# Altium project PDC.PrjPCB (part 2 of 2)

## Sheet Analog_HC_Overcurrent_Redundancy.SchDoc
size A
Used 4 times, as channels U_ANALOG_HC_OVERCURRENT_REDUNDANCY_CCT/U_Analog_HC_Overcurrent_Redundancy, U_ANALOG_HC_OVERCURRENT_REDUNDANCY_CCT/U_Analog_HC_Overcurrent_Redundancy, U_ANALOG_HC_OVERCURRENT_REDUNDANCY_CCT/U_Analog_HC_Overcurrent_Redundancy, U_ANALOG_HC_OVERCURRENT_REDUNDANCY_CCT/U_Analog_HC_Overcurrent_Redundancy. Parts and nets are listed once, with the designators drawn on the sheet.
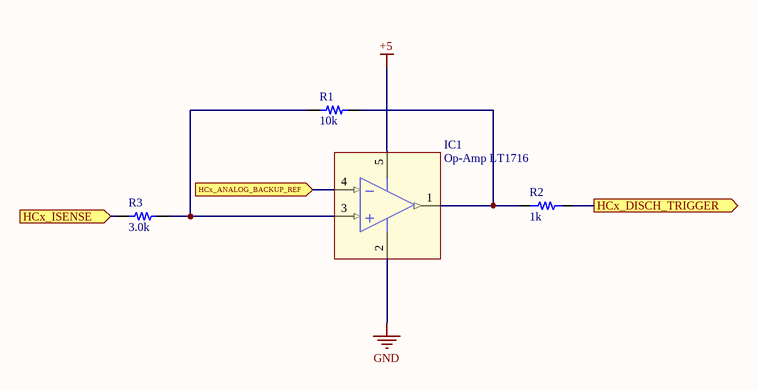
[diagram p16: Analog_HC_Overcurrent_Redundancy.SchDoc]

### Parts
IC1  Op-Amp LT1716  [SOT23-5]
R1  value 10k  [RES 0603/1608]  (hidden comment: Resistor 10k 0603 1/10W 1%)
R2  value 1k  [RES 0805/2012]  (hidden comment: Resistor 1k 0805 1/10W 1%)
R3  value 3.0k  [RES 0603/1608]  (hidden comment: Resistor 3.0k 0603 1/10W 1%)

### Ports
HCx_ANALOG_BACKUP_REF (in), HCx_DISCH_TRIGGER (out), HCx_ISENSE (in)

### Nets
+5: IC1.5(V+)
GND: IC1.2(V-)
HCx_ANALOG_BACKUP_REF: IC1.4(IN-) ; port HCx_ANALOG_BACKUP_REF
HCx_DISCH_TRIGGER: R2.2 ; port HCx_DISCH_TRIGGER
HCx_ISENSE: R3.1 ; port HCx_ISENSE
NetIC1_1: IC1.1(OUT) R1.2 R2.1
NetIC1_3: IC1.3(IN+) R1.1 R3.2

### Channels
U_ANALOG_HC_OVERCURRENT_REDUNDANCY_CCT/U_Analog_HC_Overcurrent_Redundancy: designators end in _U_ANALOG_HC_OVERCURRENT_REDUNDANCY_CCT_U_Analog_HC_Overcurrent_Redundancy#1; ports HCx_ANALOG_BACKUP_REF=HC1_ANALOG_BACKUP_REF HCx_DISCH_TRIGGER=NetQ1_15 HCx_ISENSE=HC1_ISENSE_ADC
U_ANALOG_HC_OVERCURRENT_REDUNDANCY_CCT/U_Analog_HC_Overcurrent_Redundancy: designators end in _U_ANALOG_HC_OVERCURRENT_REDUNDANCY_CCT_U_Analog_HC_Overcurrent_Redundancy#2; ports HCx_ANALOG_BACKUP_REF=HC2_ANALOG_BACKUP_REF HCx_DISCH_TRIGGER=NetQ1_13 HCx_ISENSE=HC2_ISENSE_ADC
U_ANALOG_HC_OVERCURRENT_REDUNDANCY_CCT/U_Analog_HC_Overcurrent_Redundancy: designators end in _U_ANALOG_HC_OVERCURRENT_REDUNDANCY_CCT_U_Analog_HC_Overcurrent_Redundancy#3; ports HCx_ANALOG_BACKUP_REF=HC3_ANALOG_BACKUP_REF HCx_DISCH_TRIGGER=NetQ1_11 HCx_ISENSE=HC3_ISENSE_ADC
U_ANALOG_HC_OVERCURRENT_REDUNDANCY_CCT/U_Analog_HC_Overcurrent_Redundancy: designators end in _U_ANALOG_HC_OVERCURRENT_REDUNDANCY_CCT_U_Analog_HC_Overcurrent_Redundancy#4; ports HCx_ANALOG_BACKUP_REF=HC4_ANALOG_BACKUP_REF HCx_DISCH_TRIGGER=NetQ1_9 HCx_ISENSE=HC4_ISENSE_ADC

### Library data of the parts
IC1 = 4: Manufacturer_id: 1; MfrPartNo: LT1716IS5#PBF; idOp_Amp: 4; Drawer_id: 1; Name: Op-Amp LT1716; Num_Circuits: 1
R1 = 313: Manufacturer_id: 1; idResistor: 313; Name: Res_10k_0603_1/10W_1%; Created_By: Nick Mah; Supplier 1: Digi-Key; Drawer_id: 1; Tolerance: 1%; Power: 1/10W; Package: 0603; ComponentLink1Description: Datasheet; Created_Date: 2018-10-20
R2 = 529: Manufacturer_id: 1; idResistor: 529; Name: Res_10k_0805_1/10W_1%; Created_By: Nick Mah; Supplier 1: Digi-Key; Drawer_id: 1; Tolerance: 1%; Power: 1/10W; Package: 0805; ComponentLink1Description: Datasheet; Created_Date: 2018-10-20
R3 = 300: Manufacturer_id: 1; idResistor: 300; Name: Res_3.0k_0603_1/10W_1%; Created_By: Nick Mah; Supplier 1: Digi-Key; Drawer_id: 1; Tolerance: 1%; Power: 1/10W; Package: 0603; ComponentLink1Description: Datasheet; Created_Date: 2018-10-20

## Sheet Analog_HC_Overcurrent_MMPQ3904.SchDoc
size A
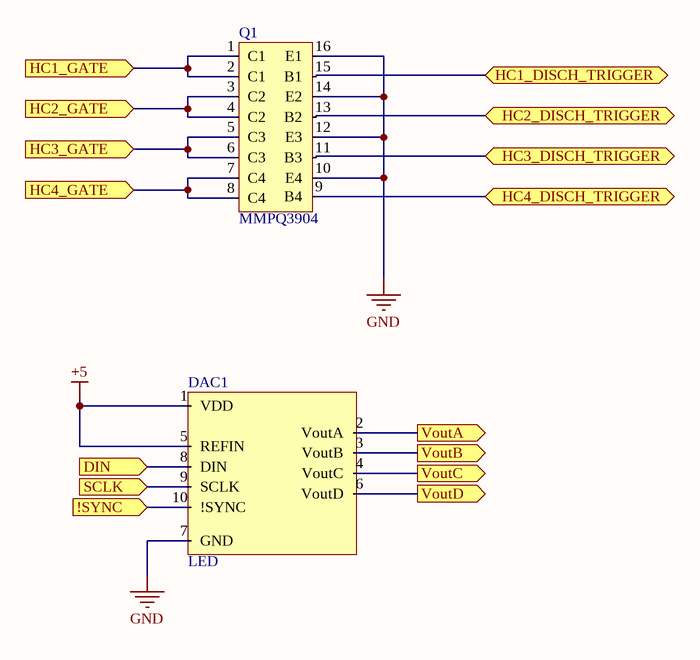
[diagram p17: Analog_HC_Overcurrent_MMPQ3904.SchDoc]

### Parts
DAC1  LED  [MSOP10 (RM-10)]
Q1  MMPQ3904  [SOIC-16-NB]

### Ports
!SYNC (in), DIN (in), HC1_DISCH_TRIGGER (bidir), HC1_GATE (in), HC2_DISCH_TRIGGER (bidir), HC2_GATE (in), HC3_DISCH_TRIGGER (bidir), HC3_GATE (in), HC4_DISCH_TRIGGER (bidir), HC4_GATE (in), SCLK (in), VoutA (out), VoutB (out), VoutC (out), VoutD (out)

### Nets
+5: DAC1.1(VDD) DAC1.5(REFIN)
GND: DAC1.7(GND) Q1.10(E4) Q1.12(E3) Q1.14(E2) Q1.16(E1)  [project net AGND]
CS: DAC1.10(!SYNC) ; port !SYNC
HC1_ANALOG_BACKUP_REF: DAC1.2(VoutA) ; port VoutA
HC1_EN: Q1.1(C1) Q1.2(C1) ; port HC1_GATE
HC2_ANALOG_BACKUP_REF: DAC1.3(VoutB) ; port VoutB
HC2_EN: Q1.3(C2) Q1.4(C2) ; port HC2_GATE
HC3_ANALOG_BACKUP_REF: DAC1.4(VoutC) ; port VoutC
HC3_EN: Q1.5(C3) Q1.6(C3) ; port HC3_GATE
HC4_ANALOG_BACKUP_REF: DAC1.6(VoutD) ; port VoutD
HC4_EN: Q1.7(C4) Q1.8(C4) ; port HC4_GATE
MOSI: DAC1.8(DIN) ; port DIN
SCK: DAC1.9(SCLK) ; port SCLK
NetQ1_9: Q1.9(B4) ; port HC4_DISCH_TRIGGER
NetQ1_11: Q1.11(B3) ; port HC3_DISCH_TRIGGER
NetQ1_13: Q1.13(B2) ; port HC2_DISCH_TRIGGER
NetQ1_15: Q1.15(B1) ; port HC1_DISCH_TRIGGER

### Library data of the parts
DAC1 = 25: 10bit 4 channel DAC; Manufacturer_id: 1; idFuse: 3; idIC_Misc: 25; Num_Circuits: 4; Vin(Min): 2.5; Vin(Max): 5.5; Drawer_id: 1; Name: AD5314ARMZ; Value: 10bit; Type: DAC; Package: MSOP-10; MfrPartNo: AD5314ARMZ; Link: https://www.digikey.com/product-detail/en/analog-devices-inc/AD5314ARMZ/AD5314ARMZ-ND/653841
Q1 = 5: Manufacturer_id: 1; idBJT: 5; Type: NPN Array; Num_Circuits: 4; hFE: 75; Ic: 200mA; Vce(Max): 40V; Created_By: Angel Delgado; MfrPartNo: MMPQ3904; Drawer_id: 1; Name: MMPQ3904; Package: SOIC-16; Link: https://www.mouser.com/ProductDetail/ON-Semiconductor-Fairchild/MMPQ3904?qs=sGAEpiMZZMshyDBzk1%2fWi8oN7VHZ91OkACYhS8H8agM%3d

## Sheet Power_supply.SchDoc
size A
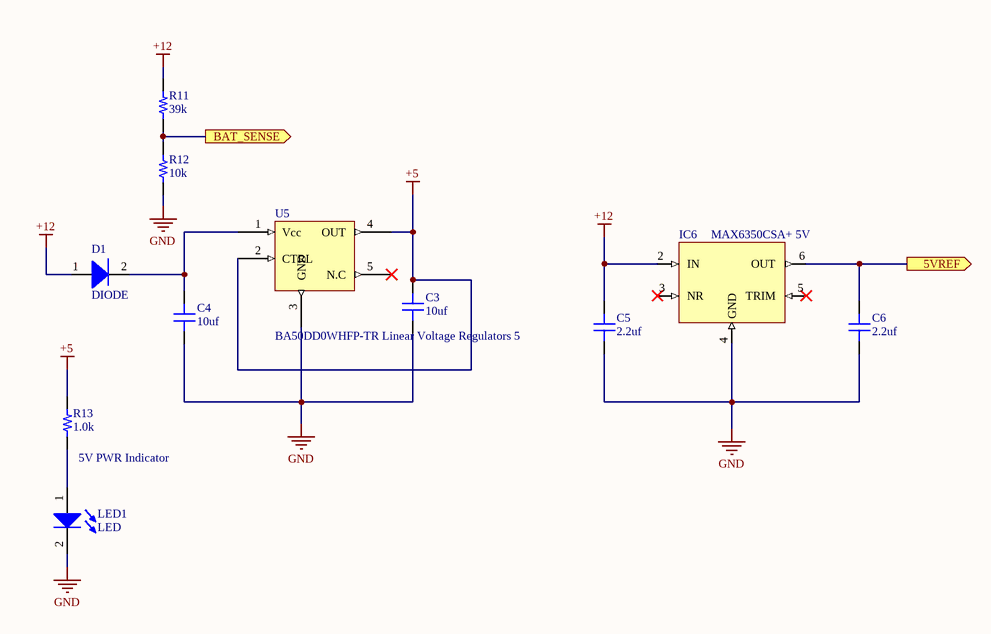
[diagram p18: Power_supply.SchDoc]

### Parts
C3  value 10uf  [CAP 0603/1608]  (hidden comment: Capacitor MLCC 10uf 16V CAP 0603/1608)
C4  value 10uf  [CAP 0603/1608]  (hidden comment: Capacitor MLCC 10uf 16V CAP 0603/1608)
C5  value 2.2uf  [CAP 0603/1608]  (hidden comment: Capacitor MLCC 2.2uf 16V CAP 0603/1608)
C6  value 2.2uf  [CAP 0603/1608]  (hidden comment: Capacitor MLCC 2.2uf 16V CAP 0603/1608)
D1  DIODE  [SOD123F]
IC6  MAX6350CSA+ 5V  [SOIC-8]
LED1  LED  [0805_LED]
R11  value 39k  [RES 0805/2012]  (hidden comment: Resistor 39k 0805 1/10W 10%)
R12  value 10k  [RES 0805/2012]  (hidden comment: Resistor 10k 0805 1/4W 10%)
R13  value 1.0k  [RES 0805/2012]  (hidden comment: Resistor 1.0k 0805 1/10W 10%)
U5  BA50DD0WHFP-TR Linear Voltage Regulators 5  [HRP5]

### Ports
5VREF (out), BAT_SENSE (out)

### Nets
+5: C3.2 R13.1 U5.2(CTRL) U5.4(OUT)
+12: C5.2 D1.1(A) IC6.2(IN) R11.2
GND: C3.1 C4.1 C5.1 C6.1 IC6.4(GND) LED1.2(K) R12.1 U5.3(GND)  [project net AGND]
5VREF: C6.2 IC6.6(OUT) ; port 5VREF
BAT_SENSE: R11.1 R12.2 ; port BAT_SENSE
NetC4_2: C4.2 D1.2(K) U5.1(Vcc)
NetLED1_1: LED1.1(A) R13.2

Not connected (* = marked no-connect by the designer): IC6 3(NR)* 5(TRIM)*; U5 5(N.C)*

### Notes on the sheet
- (near R13) 5V PWR Indicator

### Library data of the parts
C3 C4 = 235: Manufacturer_id: 1; idCapacitor: 235; Name: Cap_10uf_16V_CAP 0603/1608; Dielectric: Ceramic; Created_By: Nick Mah; Drawer_id: 1; Voltage_Rating: 16V; Package: CAP 0603/1608; Created_Date: 10/20/2018
C5 C6 = 231: Manufacturer_id: 1; idCapacitor: 231; Name: Cap_2.2uf_16V_CAP 0603/1608; Dielectric: Ceramic; Created_By: Nick Mah; Drawer_id: 1; Voltage_Rating: 16V; Package: CAP 0603/1608; Created_Date: 10/20/2018
D1 = 2: Diode Super Barrier 40V 1A Surface Mount SOD-123F; Manufacturer_id: 1; MfrPartNo: 1N5819HW1-7-F; idDiode: 2; Name: 1N5819; Drawer_id: 1; Value: 1A; Type: Super Barrier; Num_Circuits: 1; Ic: 1A; Power: 40V; Package: SOD-123; Link: https://www.digikey.com/product-detail/en/diodes-incorporated/1N5819HW1-7-F/1N5819HW1-7-FDITR-ND/5768523; ComponentLink1Description: Datasheet; ComponentLink1URL: https://www.diodes.com/assets/Datasheets/1N5819HW1.pdf; Supplier1: Digi-Key; Supplier1PartNo: 1N5819HW1-7-FDITR-ND
IC6 = 10: IC VREF SERIES 5V 8SOIC; Manufacturer_id: 1; idPMIC_Lin: 10; Name: MAX6350CSA+_5V_Ref; Vin(Max): 40V; Vout(Max): 12V; Created_By: Albert Panuco; Drawer_id: 1; Value: 5V; Output_Config: 5V; Num_Outputs: 1; Package: SOIC-8; MfrPartNo: MAX6350CSA+; Link: https://www.digikey.com/product-detail/en/maxim-integrated/MAX6350CSA/MAX6350CSA-ND/1867176; Updated_By: Albert Panuco
LED1 = 2: Manufacturer_id: 1; idLED: 2; Name: LED_0805_GREEN; Value: Green; Brightness: 35mcd; Id: 20mA; Vf: 2V; Drawer_id: 1
R11 = 2432: Manufacturer_id: 1; idResistor: 2432; Name: Res_39k_0805_1/10W_10%; Created_By: Nick Mah; Supplier 1: Digi-Key; Drawer_id: 1; Tolerance: 10%; Power: 1/10W; Package: 0805; ComponentLink1Description: Datasheet; Created_Date: 2018-10-20
R12 = 2533: Manufacturer_id: 1; idResistor: 2533; Name: Res_10k_0805_1/4W_10%; Created_By: Nick Mah; Supplier 1: Digi-Key; Drawer_id: 1; Tolerance: 10%; Power: 1/4W; Package: 0805; ComponentLink1Description: Datasheet; Created_Date: 2018-10-20
R13 = 2413: Manufacturer_id: 1; idResistor: 2413; Name: Res_1.0k_0805_1/10W_10%; Created_By: Nick Mah; Supplier 1: Digi-Key; Drawer_id: 1; Tolerance: 10%; Power: 1/10W; Package: 0805; ComponentLink1Description: Datasheet; Created_Date: 2018-10-20
U5 = 6: Manufacturer_id: 1; idPMIC_Lin: 6; Name: BA50DD0WHFP-TR Linear Voltage Regulator 5; Value: 5V; Vin(Min): 3V; Vin(Max): 33V; Current_Rating: 2A; Dropout_Voltage: 0.7V; Drawer_id: 1; Vout(Max): 5V; MfrPartNo: BA50DD0WHFP-TR; Link: https://www.mouser.com/ProductDetail/ROHM-Semiconductor/BA50DD0WHFP-TR?qs=4kLU8WoGk0sFpKnESpdNFg%3D%3D

## Sheet Input_Current_Limiting.SchDoc
size B
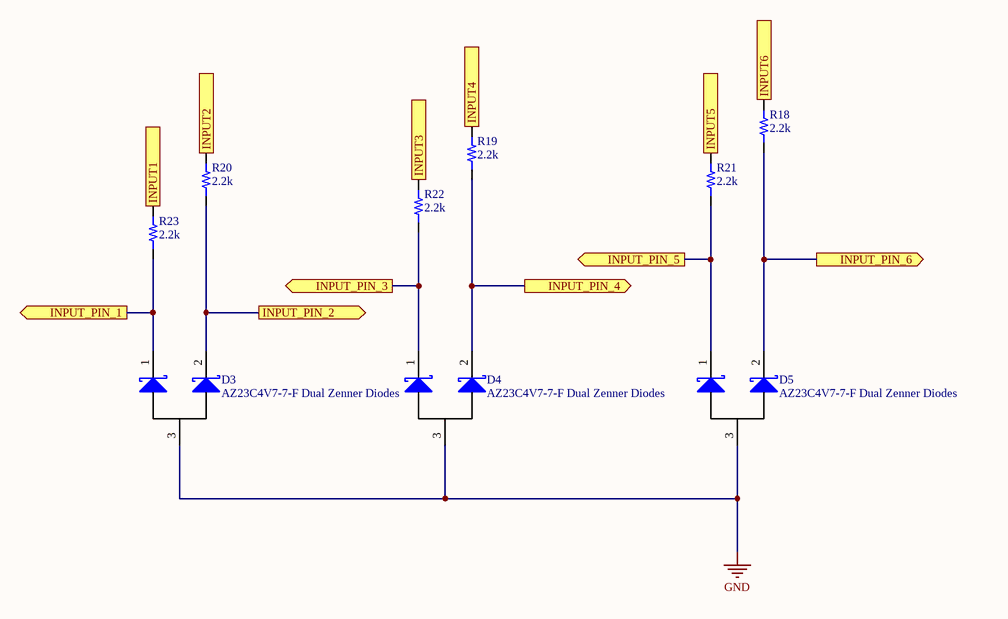
[diagram p19: Input_Current_Limiting.SchDoc]

### Parts
D3  AZ23C4V7-7-F Dual Zenner Diodes  [SOT23-3]
D4  AZ23C4V7-7-F Dual Zenner Diodes  [SOT23-3]
D5  AZ23C4V7-7-F Dual Zenner Diodes  [SOT23-3]
R18  value 2.2k  [RES 0603/1608]  (hidden comment: Resistor 2.2k 0603 1/10W 1%)
R19  value 2.2k  [RES 0603/1608]  (hidden comment: Resistor 2.2k 0603 1/10W 1%)
R20  value 2.2k  [RES 0603/1608]  (hidden comment: Resistor 2.2k 0603 1/10W 1%)
R21  value 2.2k  [RES 0603/1608]  (hidden comment: Resistor 2.2k 0603 1/10W 1%)
R22  value 2.2k  [RES 0603/1608]  (hidden comment: Resistor 2.2k 0603 1/10W 1%)
R23  value 2.2k  [RES 0603/1608]  (hidden comment: Resistor 2.2k 0603 1/10W 1%)

### Ports
INPUT1 (in), INPUT2 (in), INPUT3 (in), INPUT4 (in), INPUT5 (in), INPUT6 (in), INPUT_PIN_1 (out), INPUT_PIN_2 (out), INPUT_PIN_3 (out), INPUT_PIN_4 (out), INPUT_PIN_5 (out), INPUT_PIN_6 (out)

### Nets
GND: D3.3 D4.3 D5.3  [project net AGND]
D_IN_1: R19.2 ; port INPUT4
D_IN_2: R21.2 ; port INPUT5
D_IN_3: R18.2 ; port INPUT6
D_OUT_1: D3.1 R23.1 ; port INPUT_PIN_1
D_OUT_2: D3.2 R20.1 ; port INPUT_PIN_2
D_OUT_3: D4.1 R22.1 ; port INPUT_PIN_3
D_OUT_4: D4.2 R19.1 ; port INPUT_PIN_4
D_OUT_5: D5.1 R21.1 ; port INPUT_PIN_5
D_OUT_6: D5.2 R18.1 ; port INPUT_PIN_6
Relay_Sig_HC_1: R23.2 ; port INPUT1
Relay_Sig_HC_2: R20.2 ; port INPUT2
Relay_Sig_LC: R22.2 ; port INPUT3

### Library data of the parts
D3-D5 = 14: DIODE ZENER ARRAY 4.7V SOT23-3; Manufacturer_id: 1; idDiode: 14; Num_Circuits: 2; Power: 300mW; Created_By: Angel Delgado; Drawer_id: 1; Name: AZ23C4V7-7-F; Value: 4.7V; Type: Zener Array; Package: SOT23-3; MfrPartNo: AZ23C4V7-7-F; Link: https://www.digikey.com/product-detail/en/diodes-incorporated/AZ23C4V7-7-F/AZ23C4V7-FDICT-ND/815309; Supplier1: Digi-Key
R18-R23 = 297: Manufacturer_id: 1; idResistor: 297; Name: Res_2.2k_0603_1/10W_1%; Created_By: Nick Mah; Supplier 1: Digi-Key; Drawer_id: 1; Tolerance: 1%; Power: 1/10W; Package: 0603; ComponentLink1Description: Datasheet; Created_Date: 2018-10-20

## Nets that join several sheets
+5: U_LOW_CURRENT_OUTPUTS/U_PDC_Low_Current_Outputs (IC5_U_LOW_CURRENT_OUTPUTS_U_PDC_Low_Current_Outputs#1.2), U_LOW_CURRENT_OUTPUTS/U_PDC_Low_Current_Outputs (IC5_U_LOW_CURRENT_OUTPUTS_U_PDC_Low_Current_Outputs#2.2), U_LOW_CURRENT_OUTPUTS/U_PDC_Low_Current_Outputs (IC5_U_LOW_CURRENT_OUTPUTS_U_PDC_Low_Current_Outputs#3.2), U_LOW_CURRENT_OUTPUTS/U_PDC_Low_Current_Outputs (IC5_U_LOW_CURRENT_OUTPUTS_U_PDC_Low_Current_Outputs#4.2), U_LOW_CURRENT_OUTPUTS/U_PDC_Low_Current_Outputs (IC5_U_LOW_CURRENT_OUTPUTS_U_PDC_Low_Current_Outputs#5.2), U_LOW_CURRENT_OUTPUTS/U_PDC_Low_Current_Outputs (IC5_U_LOW_CURRENT_OUTPUTS_U_PDC_Low_Current_Outputs#6.2), U_LOW_CURRENT_OUTPUTS/U_PDC_Low_Current_Outputs (IC5_U_LOW_CURRENT_OUTPUTS_U_PDC_Low_Current_Outputs#7.2), U_LOW_CURRENT_OUTPUTS/U_PDC_Low_Current_Outputs (IC5_U_LOW_CURRENT_OUTPUTS_U_PDC_Low_Current_Outputs#8.2), E_stop (R31.2), Reset_Pin (D6.2 R26.2), Temperature_Sensing (U6.1), U_HIGH_CURRENT_OUTPUTS/U_PDC_high_Current_Outputs (U1_U_HIGH_CURRENT_OUTPUTS_U_PDC_high_Current_Outputs#1.2), U_HIGH_CURRENT_OUTPUTS/U_PDC_high_Current_Outputs (U1_U_HIGH_CURRENT_OUTPUTS_U_PDC_high_Current_Outputs#2.2), U_HIGH_CURRENT_OUTPUTS/U_PDC_high_Current_Outputs (U1_U_HIGH_CURRENT_OUTPUTS_U_PDC_high_Current_Outputs#3.2), U_HIGH_CURRENT_OUTPUTS/U_PDC_high_Current_Outputs (U1_U_HIGH_CURRENT_OUTPUTS_U_PDC_high_Current_Outputs#4.2), U_ANALOG_HC_OVERCURRENT_REDUNDANCY_CCT/U_Analog_HC_Overcurrent_Redundancy (IC1_U_ANALOG_HC_OVERCURRENT_REDUNDANCY_CCT_U_Analog_HC_Overcurrent_Redundancy#1.5), U_ANALOG_HC_OVERCURRENT_REDUNDANCY_CCT/U_Analog_HC_Overcurrent_Redundancy (IC1_U_ANALOG_HC_OVERCURRENT_REDUNDANCY_CCT_U_Analog_HC_Overcurrent_Redundancy#2.5), U_ANALOG_HC_OVERCURRENT_REDUNDANCY_CCT/U_Analog_HC_Overcurrent_Redundancy (IC1_U_ANALOG_HC_OVERCURRENT_REDUNDANCY_CCT_U_Analog_HC_Overcurrent_Redundancy#3.5), U_ANALOG_HC_OVERCURRENT_REDUNDANCY_CCT/U_Analog_HC_Overcurrent_Redundancy (IC1_U_ANALOG_HC_OVERCURRENT_REDUNDANCY_CCT_U_Analog_HC_Overcurrent_Redundancy#4.5), Analog_HC_Overcurrent_MMPQ3904 (DAC1.1 DAC1.5), Power_supply (C3.2 R13.1 U5.2 U5.4)
+12: U_LOW_CURRENT_OUTPUTS/U_PDC_Low_Current_Outputs (IC5_U_LOW_CURRENT_OUTPUTS_U_PDC_Low_Current_Outputs#1.8 R8_U_LOW_CURRENT_OUTPUTS_U_PDC_Low_Current_Outputs#1.2), U_LOW_CURRENT_OUTPUTS/U_PDC_Low_Current_Outputs (IC5_U_LOW_CURRENT_OUTPUTS_U_PDC_Low_Current_Outputs#2.8 R8_U_LOW_CURRENT_OUTPUTS_U_PDC_Low_Current_Outputs#2.2), U_LOW_CURRENT_OUTPUTS/U_PDC_Low_Current_Outputs (IC5_U_LOW_CURRENT_OUTPUTS_U_PDC_Low_Current_Outputs#3.8 R8_U_LOW_CURRENT_OUTPUTS_U_PDC_Low_Current_Outputs#3.2), U_LOW_CURRENT_OUTPUTS/U_PDC_Low_Current_Outputs (IC5_U_LOW_CURRENT_OUTPUTS_U_PDC_Low_Current_Outputs#4.8 R8_U_LOW_CURRENT_OUTPUTS_U_PDC_Low_Current_Outputs#4.2), U_LOW_CURRENT_OUTPUTS/U_PDC_Low_Current_Outputs (IC5_U_LOW_CURRENT_OUTPUTS_U_PDC_Low_Current_Outputs#5.8 R8_U_LOW_CURRENT_OUTPUTS_U_PDC_Low_Current_Outputs#5.2), U_LOW_CURRENT_OUTPUTS/U_PDC_Low_Current_Outputs (IC5_U_LOW_CURRENT_OUTPUTS_U_PDC_Low_Current_Outputs#6.8 R8_U_LOW_CURRENT_OUTPUTS_U_PDC_Low_Current_Outputs#6.2), U_LOW_CURRENT_OUTPUTS/U_PDC_Low_Current_Outputs (IC5_U_LOW_CURRENT_OUTPUTS_U_PDC_Low_Current_Outputs#7.8 R8_U_LOW_CURRENT_OUTPUTS_U_PDC_Low_Current_Outputs#7.2), U_LOW_CURRENT_OUTPUTS/U_PDC_Low_Current_Outputs (IC5_U_LOW_CURRENT_OUTPUTS_U_PDC_Low_Current_Outputs#8.8 R8_U_LOW_CURRENT_OUTPUTS_U_PDC_Low_Current_Outputs#8.2), U_LOW_CURRENT_OUTPUTS/U_PDC_Gate_Driver (IC4_U_LOW_CURRENT_OUTPUTS_U_PDC_Gate_Driver#1.11 IC4_U_LOW_CURRENT_OUTPUTS_U_PDC_Gate_Driver#1.20), U_LOW_CURRENT_OUTPUTS/U_PDC_Gate_Driver (IC4_U_LOW_CURRENT_OUTPUTS_U_PDC_Gate_Driver#2.11 IC4_U_LOW_CURRENT_OUTPUTS_U_PDC_Gate_Driver#2.20), Gate_driver (IC3.11 IC3.20), Rectifier_shutdown_LT1910 (R14.1 U3.4 U3.6 U3.8), U_HIGH_CURRENT_OUTPUTS/U_PDC_high_Current_Outputs (R5_U_HIGH_CURRENT_OUTPUTS_U_PDC_high_Current_Outputs#1.2 U1_U_HIGH_CURRENT_OUTPUTS_U_PDC_high_Current_Outputs#1.8), U_HIGH_CURRENT_OUTPUTS/U_PDC_high_Current_Outputs (R5_U_HIGH_CURRENT_OUTPUTS_U_PDC_high_Current_Outputs#2.2 U1_U_HIGH_CURRENT_OUTPUTS_U_PDC_high_Current_Outputs#2.8), U_HIGH_CURRENT_OUTPUTS/U_PDC_high_Current_Outputs (R5_U_HIGH_CURRENT_OUTPUTS_U_PDC_high_Current_Outputs#3.2 U1_U_HIGH_CURRENT_OUTPUTS_U_PDC_high_Current_Outputs#3.8), U_HIGH_CURRENT_OUTPUTS/U_PDC_high_Current_Outputs (R5_U_HIGH_CURRENT_OUTPUTS_U_PDC_high_Current_Outputs#4.2 U1_U_HIGH_CURRENT_OUTPUTS_U_PDC_high_Current_Outputs#4.8), Power_supply (C5.2 D1.1 IC6.2 R11.2)
AGND: Superseal (22 pins), U_LOW_CURRENT_OUTPUTS/U_PDC_Low_Current_Outputs (C2_U_LOW_CURRENT_OUTPUTS_U_PDC_Low_Current_Outputs#1.1 IC5_U_LOW_CURRENT_OUTPUTS_U_PDC_Low_Current_Outputs#1.4 IC5_U_LOW_CURRENT_OUTPUTS_U_PDC_Low_Current_Outputs#1.7 R10_U_LOW_CURRENT_OUTPUTS_U_PDC_Low_Current_Outputs#1.1), U_LOW_CURRENT_OUTPUTS/U_PDC_Low_Current_Outputs (C2_U_LOW_CURRENT_OUTPUTS_U_PDC_Low_Current_Outputs#2.1 IC5_U_LOW_CURRENT_OUTPUTS_U_PDC_Low_Current_Outputs#2.4 IC5_U_LOW_CURRENT_OUTPUTS_U_PDC_Low_Current_Outputs#2.7 R10_U_LOW_CURRENT_OUTPUTS_U_PDC_Low_Current_Outputs#2.1), U_LOW_CURRENT_OUTPUTS/U_PDC_Low_Current_Outputs (C2_U_LOW_CURRENT_OUTPUTS_U_PDC_Low_Current_Outputs#3.1 IC5_U_LOW_CURRENT_OUTPUTS_U_PDC_Low_Current_Outputs#3.4 IC5_U_LOW_CURRENT_OUTPUTS_U_PDC_Low_Current_Outputs#3.7 R10_U_LOW_CURRENT_OUTPUTS_U_PDC_Low_Current_Outputs#3.1), U_LOW_CURRENT_OUTPUTS/U_PDC_Low_Current_Outputs (C2_U_LOW_CURRENT_OUTPUTS_U_PDC_Low_Current_Outputs#4.1 IC5_U_LOW_CURRENT_OUTPUTS_U_PDC_Low_Current_Outputs#4.4 IC5_U_LOW_CURRENT_OUTPUTS_U_PDC_Low_Current_Outputs#4.7 R10_U_LOW_CURRENT_OUTPUTS_U_PDC_Low_Current_Outputs#4.1), U_LOW_CURRENT_OUTPUTS/U_PDC_Low_Current_Outputs (C2_U_LOW_CURRENT_OUTPUTS_U_PDC_Low_Current_Outputs#5.1 IC5_U_LOW_CURRENT_OUTPUTS_U_PDC_Low_Current_Outputs#5.4 IC5_U_LOW_CURRENT_OUTPUTS_U_PDC_Low_Current_Outputs#5.7 R10_U_LOW_CURRENT_OUTPUTS_U_PDC_Low_Current_Outputs#5.1), U_LOW_CURRENT_OUTPUTS/U_PDC_Low_Current_Outputs (C2_U_LOW_CURRENT_OUTPUTS_U_PDC_Low_Current_Outputs#6.1 IC5_U_LOW_CURRENT_OUTPUTS_U_PDC_Low_Current_Outputs#6.4 IC5_U_LOW_CURRENT_OUTPUTS_U_PDC_Low_Current_Outputs#6.7 R10_U_LOW_CURRENT_OUTPUTS_U_PDC_Low_Current_Outputs#6.1), U_LOW_CURRENT_OUTPUTS/U_PDC_Low_Current_Outputs (C2_U_LOW_CURRENT_OUTPUTS_U_PDC_Low_Current_Outputs#7.1 IC5_U_LOW_CURRENT_OUTPUTS_U_PDC_Low_Current_Outputs#7.4 IC5_U_LOW_CURRENT_OUTPUTS_U_PDC_Low_Current_Outputs#7.7 R10_U_LOW_CURRENT_OUTPUTS_U_PDC_Low_Current_Outputs#7.1), U_LOW_CURRENT_OUTPUTS/U_PDC_Low_Current_Outputs (C2_U_LOW_CURRENT_OUTPUTS_U_PDC_Low_Current_Outputs#8.1 IC5_U_LOW_CURRENT_OUTPUTS_U_PDC_Low_Current_Outputs#8.4 IC5_U_LOW_CURRENT_OUTPUTS_U_PDC_Low_Current_Outputs#8.7 R10_U_LOW_CURRENT_OUTPUTS_U_PDC_Low_Current_Outputs#8.1), U_LOW_CURRENT_OUTPUTS/U_PDC_Gate_Driver (6 pins), U_LOW_CURRENT_OUTPUTS/U_PDC_Gate_Driver (6 pins), Gate_driver (6 pins), Reset_Pin (C13.1 W1.1), Temperature_Sensing (U6.3), Rectifier_shutdown_LT1910 (U3.1), U_HIGH_CURRENT_OUTPUTS/U_PDC_high_Current_Outputs (5 pins), U_HIGH_CURRENT_OUTPUTS/U_PDC_high_Current_Outputs (5 pins), U_HIGH_CURRENT_OUTPUTS/U_PDC_high_Current_Outputs (5 pins), U_HIGH_CURRENT_OUTPUTS/U_PDC_high_Current_Outputs (5 pins), U_ANALOG_HC_OVERCURRENT_REDUNDANCY_CCT/U_Analog_HC_Overcurrent_Redundancy (IC1_U_ANALOG_HC_OVERCURRENT_REDUNDANCY_CCT_U_Analog_HC_Overcurrent_Redundancy#1.2), U_ANALOG_HC_OVERCURRENT_REDUNDANCY_CCT/U_Analog_HC_Overcurrent_Redundancy (IC1_U_ANALOG_HC_OVERCURRENT_REDUNDANCY_CCT_U_Analog_HC_Overcurrent_Redundancy#2.2), U_ANALOG_HC_OVERCURRENT_REDUNDANCY_CCT/U_Analog_HC_Overcurrent_Redundancy (IC1_U_ANALOG_HC_OVERCURRENT_REDUNDANCY_CCT_U_Analog_HC_Overcurrent_Redundancy#3.2), U_ANALOG_HC_OVERCURRENT_REDUNDANCY_CCT/U_Analog_HC_Overcurrent_Redundancy (IC1_U_ANALOG_HC_OVERCURRENT_REDUNDANCY_CCT_U_Analog_HC_Overcurrent_Redundancy#4.2), Analog_HC_Overcurrent_MMPQ3904 (5 pins), Power_supply (8 pins), Input_Current_Limiting (D3.3 D4.3 D5.3)
D_IN_1: Superseal (X1.A29), Input_Current_Limiting (R19.2)
D_IN_2: Superseal (X1.A21), Input_Current_Limiting (R21.2)
D_IN_3: Superseal (X1.A20), Input_Current_Limiting (R18.2)
EMERGENCY_SHUTDOWN: Superseal (X1.A12), E_stop (R4.2)
HC1_ANALOG_BACKUP_REF: U_ANALOG_HC_OVERCURRENT_REDUNDANCY_CCT/U_Analog_HC_Overcurrent_Redundancy (IC1_U_ANALOG_HC_OVERCURRENT_REDUNDANCY_CCT_U_Analog_HC_Overcurrent_Redundancy#1.4), Analog_HC_Overcurrent_MMPQ3904 (DAC1.2)
HC1_EN: PDC (R32.1), E_stop (IC2.16), Analog_HC_Overcurrent_MMPQ3904 (Q1.1 Q1.2)
HC1_GATE: Gate_driver (IC3.18), U_HIGH_CURRENT_OUTPUTS/U_PDC_high_Current_Outputs (T1_U_HIGH_CURRENT_OUTPUTS_U_PDC_high_Current_Outputs#1.4 T2_U_HIGH_CURRENT_OUTPUTS_U_PDC_high_Current_Outputs#1.4)
HC1_ISENSE_ADC: U_HIGH_CURRENT_OUTPUTS/U_PDC_high_Current_Outputs (U1_U_HIGH_CURRENT_OUTPUTS_U_PDC_high_Current_Outputs#1.5), U_ANALOG_HC_OVERCURRENT_REDUNDANCY_CCT/U_Analog_HC_Overcurrent_Redundancy (R3_U_ANALOG_HC_OVERCURRENT_REDUNDANCY_CCT_U_Analog_HC_Overcurrent_Redundancy#1.1)
HC1_OCSense: Gate_driver (IC3.19), U_HIGH_CURRENT_OUTPUTS/U_PDC_high_Current_Outputs (R5_U_HIGH_CURRENT_OUTPUTS_U_PDC_high_Current_Outputs#1.1 T1_U_HIGH_CURRENT_OUTPUTS_U_PDC_high_Current_Outputs#1.mb T2_U_HIGH_CURRENT_OUTPUTS_U_PDC_high_Current_Outputs#1.mb U1_U_HIGH_CURRENT_OUTPUTS_U_PDC_high_Current_Outputs#1.1)
HC2_ANALOG_BACKUP_REF: U_ANALOG_HC_OVERCURRENT_REDUNDANCY_CCT/U_Analog_HC_Overcurrent_Redundancy (IC1_U_ANALOG_HC_OVERCURRENT_REDUNDANCY_CCT_U_Analog_HC_Overcurrent_Redundancy#2.4), Analog_HC_Overcurrent_MMPQ3904 (DAC1.3)
HC2_EN: PDC (R33.1), E_stop (IC2.14), Analog_HC_Overcurrent_MMPQ3904 (Q1.3 Q1.4)
HC2_GATE: Gate_driver (IC3.16), U_HIGH_CURRENT_OUTPUTS/U_PDC_high_Current_Outputs (T1_U_HIGH_CURRENT_OUTPUTS_U_PDC_high_Current_Outputs#2.4 T2_U_HIGH_CURRENT_OUTPUTS_U_PDC_high_Current_Outputs#2.4)
HC2_ISENSE_ADC: U_HIGH_CURRENT_OUTPUTS/U_PDC_high_Current_Outputs (U1_U_HIGH_CURRENT_OUTPUTS_U_PDC_high_Current_Outputs#2.5), U_ANALOG_HC_OVERCURRENT_REDUNDANCY_CCT/U_Analog_HC_Overcurrent_Redundancy (R3_U_ANALOG_HC_OVERCURRENT_REDUNDANCY_CCT_U_Analog_HC_Overcurrent_Redundancy#2.1)
HC2_OCSense: Gate_driver (IC3.17), U_HIGH_CURRENT_OUTPUTS/U_PDC_high_Current_Outputs (R5_U_HIGH_CURRENT_OUTPUTS_U_PDC_high_Current_Outputs#2.1 T1_U_HIGH_CURRENT_OUTPUTS_U_PDC_high_Current_Outputs#2.mb T2_U_HIGH_CURRENT_OUTPUTS_U_PDC_high_Current_Outputs#2.mb U1_U_HIGH_CURRENT_OUTPUTS_U_PDC_high_Current_Outputs#2.1)
HC3_ANALOG_BACKUP_REF: U_ANALOG_HC_OVERCURRENT_REDUNDANCY_CCT/U_Analog_HC_Overcurrent_Redundancy (IC1_U_ANALOG_HC_OVERCURRENT_REDUNDANCY_CCT_U_Analog_HC_Overcurrent_Redundancy#3.4), Analog_HC_Overcurrent_MMPQ3904 (DAC1.4)
HC3_EN: PDC (R34.1), E_stop (IC2.12), Analog_HC_Overcurrent_MMPQ3904 (Q1.5 Q1.6)
HC3_GATE: Gate_driver (IC3.14), U_HIGH_CURRENT_OUTPUTS/U_PDC_high_Current_Outputs (T1_U_HIGH_CURRENT_OUTPUTS_U_PDC_high_Current_Outputs#3.4 T2_U_HIGH_CURRENT_OUTPUTS_U_PDC_high_Current_Outputs#3.4)
HC3_ISENSE_ADC: U_HIGH_CURRENT_OUTPUTS/U_PDC_high_Current_Outputs (U1_U_HIGH_CURRENT_OUTPUTS_U_PDC_high_Current_Outputs#3.5), U_ANALOG_HC_OVERCURRENT_REDUNDANCY_CCT/U_Analog_HC_Overcurrent_Redundancy (R3_U_ANALOG_HC_OVERCURRENT_REDUNDANCY_CCT_U_Analog_HC_Overcurrent_Redundancy#3.1)
HC3_OCSense: Gate_driver (IC3.15), U_HIGH_CURRENT_OUTPUTS/U_PDC_high_Current_Outputs (R5_U_HIGH_CURRENT_OUTPUTS_U_PDC_high_Current_Outputs#3.1 T1_U_HIGH_CURRENT_OUTPUTS_U_PDC_high_Current_Outputs#3.mb T2_U_HIGH_CURRENT_OUTPUTS_U_PDC_high_Current_Outputs#3.mb U1_U_HIGH_CURRENT_OUTPUTS_U_PDC_high_Current_Outputs#3.1)
HC4_ANALOG_BACKUP_REF: U_ANALOG_HC_OVERCURRENT_REDUNDANCY_CCT/U_Analog_HC_Overcurrent_Redundancy (IC1_U_ANALOG_HC_OVERCURRENT_REDUNDANCY_CCT_U_Analog_HC_Overcurrent_Redundancy#4.4), Analog_HC_Overcurrent_MMPQ3904 (DAC1.6)
HC4_EN: PDC (R35.1), E_stop (IC2.10), Analog_HC_Overcurrent_MMPQ3904 (Q1.7 Q1.8)
HC4_GATE: Gate_driver (IC3.12), U_HIGH_CURRENT_OUTPUTS/U_PDC_high_Current_Outputs (T1_U_HIGH_CURRENT_OUTPUTS_U_PDC_high_Current_Outputs#4.4 T2_U_HIGH_CURRENT_OUTPUTS_U_PDC_high_Current_Outputs#4.4)
HC4_ISENSE_ADC: U_HIGH_CURRENT_OUTPUTS/U_PDC_high_Current_Outputs (U1_U_HIGH_CURRENT_OUTPUTS_U_PDC_high_Current_Outputs#4.5), U_ANALOG_HC_OVERCURRENT_REDUNDANCY_CCT/U_Analog_HC_Overcurrent_Redundancy (R3_U_ANALOG_HC_OVERCURRENT_REDUNDANCY_CCT_U_Analog_HC_Overcurrent_Redundancy#4.1)
HC4_OCSense: Gate_driver (IC3.13), U_HIGH_CURRENT_OUTPUTS/U_PDC_high_Current_Outputs (R5_U_HIGH_CURRENT_OUTPUTS_U_PDC_high_Current_Outputs#4.1 T1_U_HIGH_CURRENT_OUTPUTS_U_PDC_high_Current_Outputs#4.mb T2_U_HIGH_CURRENT_OUTPUTS_U_PDC_high_Current_Outputs#4.mb U1_U_HIGH_CURRENT_OUTPUTS_U_PDC_high_Current_Outputs#4.1)
HC_1_OUTPUT: Superseal (X1.A2 X1.A11), U_HIGH_CURRENT_OUTPUTS/U_PDC_high_Current_Outputs (7 pins)
HC_2_OUTPUT: Superseal (X1.A3 X1.A4), U_HIGH_CURRENT_OUTPUTS/U_PDC_high_Current_Outputs (7 pins)
HC_3_OUTPUT: Superseal (X1.B5 X1.B11), U_HIGH_CURRENT_OUTPUTS/U_PDC_high_Current_Outputs (7 pins)
HC_4_OUTPUT: Superseal (X1.B6 X1.B12), U_HIGH_CURRENT_OUTPUTS/U_PDC_high_Current_Outputs (7 pins)
LC1_GATE: U_LOW_CURRENT_OUTPUTS/U_PDC_Low_Current_Outputs (T3_U_LOW_CURRENT_OUTPUTS_U_PDC_Low_Current_Outputs#1.4), U_LOW_CURRENT_OUTPUTS/U_PDC_Gate_Driver (IC4_U_LOW_CURRENT_OUTPUTS_U_PDC_Gate_Driver#1.18)
LC1_OCSense: U_LOW_CURRENT_OUTPUTS/U_PDC_Low_Current_Outputs (IC5_U_LOW_CURRENT_OUTPUTS_U_PDC_Low_Current_Outputs#1.1 R8_U_LOW_CURRENT_OUTPUTS_U_PDC_Low_Current_Outputs#1.1 T3_U_LOW_CURRENT_OUTPUTS_U_PDC_Low_Current_Outputs#1.mb), U_LOW_CURRENT_OUTPUTS/U_PDC_Gate_Driver (IC4_U_LOW_CURRENT_OUTPUTS_U_PDC_Gate_Driver#1.19)
LC2_GATE: U_LOW_CURRENT_OUTPUTS/U_PDC_Low_Current_Outputs (T3_U_LOW_CURRENT_OUTPUTS_U_PDC_Low_Current_Outputs#2.4), U_LOW_CURRENT_OUTPUTS/U_PDC_Gate_Driver (IC4_U_LOW_CURRENT_OUTPUTS_U_PDC_Gate_Driver#1.16)
LC2_OCSense: U_LOW_CURRENT_OUTPUTS/U_PDC_Low_Current_Outputs (IC5_U_LOW_CURRENT_OUTPUTS_U_PDC_Low_Current_Outputs#2.1 R8_U_LOW_CURRENT_OUTPUTS_U_PDC_Low_Current_Outputs#2.1 T3_U_LOW_CURRENT_OUTPUTS_U_PDC_Low_Current_Outputs#2.mb), U_LOW_CURRENT_OUTPUTS/U_PDC_Gate_Driver (IC4_U_LOW_CURRENT_OUTPUTS_U_PDC_Gate_Driver#1.17)
LC3_GATE: U_LOW_CURRENT_OUTPUTS/U_PDC_Low_Current_Outputs (T3_U_LOW_CURRENT_OUTPUTS_U_PDC_Low_Current_Outputs#3.4), U_LOW_CURRENT_OUTPUTS/U_PDC_Gate_Driver (IC4_U_LOW_CURRENT_OUTPUTS_U_PDC_Gate_Driver#1.14)
LC3_OCSense: U_LOW_CURRENT_OUTPUTS/U_PDC_Low_Current_Outputs (IC5_U_LOW_CURRENT_OUTPUTS_U_PDC_Low_Current_Outputs#3.1 R8_U_LOW_CURRENT_OUTPUTS_U_PDC_Low_Current_Outputs#3.1 T3_U_LOW_CURRENT_OUTPUTS_U_PDC_Low_Current_Outputs#3.mb), U_LOW_CURRENT_OUTPUTS/U_PDC_Gate_Driver (IC4_U_LOW_CURRENT_OUTPUTS_U_PDC_Gate_Driver#1.15)
LC4_GATE: U_LOW_CURRENT_OUTPUTS/U_PDC_Low_Current_Outputs (T3_U_LOW_CURRENT_OUTPUTS_U_PDC_Low_Current_Outputs#4.4), U_LOW_CURRENT_OUTPUTS/U_PDC_Gate_Driver (IC4_U_LOW_CURRENT_OUTPUTS_U_PDC_Gate_Driver#1.12)
LC4_OCSense: U_LOW_CURRENT_OUTPUTS/U_PDC_Low_Current_Outputs (IC5_U_LOW_CURRENT_OUTPUTS_U_PDC_Low_Current_Outputs#4.1 R8_U_LOW_CURRENT_OUTPUTS_U_PDC_Low_Current_Outputs#4.1 T3_U_LOW_CURRENT_OUTPUTS_U_PDC_Low_Current_Outputs#4.mb), U_LOW_CURRENT_OUTPUTS/U_PDC_Gate_Driver (IC4_U_LOW_CURRENT_OUTPUTS_U_PDC_Gate_Driver#1.13)
LC5_GATE: U_LOW_CURRENT_OUTPUTS/U_PDC_Low_Current_Outputs (T3_U_LOW_CURRENT_OUTPUTS_U_PDC_Low_Current_Outputs#5.4), U_LOW_CURRENT_OUTPUTS/U_PDC_Gate_Driver (IC4_U_LOW_CURRENT_OUTPUTS_U_PDC_Gate_Driver#2.18)
LC5_OCSense: U_LOW_CURRENT_OUTPUTS/U_PDC_Low_Current_Outputs (IC5_U_LOW_CURRENT_OUTPUTS_U_PDC_Low_Current_Outputs#5.1 R8_U_LOW_CURRENT_OUTPUTS_U_PDC_Low_Current_Outputs#5.1 T3_U_LOW_CURRENT_OUTPUTS_U_PDC_Low_Current_Outputs#5.mb), U_LOW_CURRENT_OUTPUTS/U_PDC_Gate_Driver (IC4_U_LOW_CURRENT_OUTPUTS_U_PDC_Gate_Driver#2.19)
LC6_GATE: U_LOW_CURRENT_OUTPUTS/U_PDC_Low_Current_Outputs (T3_U_LOW_CURRENT_OUTPUTS_U_PDC_Low_Current_Outputs#6.4), U_LOW_CURRENT_OUTPUTS/U_PDC_Gate_Driver (IC4_U_LOW_CURRENT_OUTPUTS_U_PDC_Gate_Driver#2.16)
LC6_OCSense: U_LOW_CURRENT_OUTPUTS/U_PDC_Low_Current_Outputs (IC5_U_LOW_CURRENT_OUTPUTS_U_PDC_Low_Current_Outputs#6.1 R8_U_LOW_CURRENT_OUTPUTS_U_PDC_Low_Current_Outputs#6.1 T3_U_LOW_CURRENT_OUTPUTS_U_PDC_Low_Current_Outputs#6.mb), U_LOW_CURRENT_OUTPUTS/U_PDC_Gate_Driver (IC4_U_LOW_CURRENT_OUTPUTS_U_PDC_Gate_Driver#2.17)
LC7_GATE: U_LOW_CURRENT_OUTPUTS/U_PDC_Low_Current_Outputs (T3_U_LOW_CURRENT_OUTPUTS_U_PDC_Low_Current_Outputs#7.4), U_LOW_CURRENT_OUTPUTS/U_PDC_Gate_Driver (IC4_U_LOW_CURRENT_OUTPUTS_U_PDC_Gate_Driver#2.14)
LC7_OCSense: U_LOW_CURRENT_OUTPUTS/U_PDC_Low_Current_Outputs (IC5_U_LOW_CURRENT_OUTPUTS_U_PDC_Low_Current_Outputs#7.1 R8_U_LOW_CURRENT_OUTPUTS_U_PDC_Low_Current_Outputs#7.1 T3_U_LOW_CURRENT_OUTPUTS_U_PDC_Low_Current_Outputs#7.mb), U_LOW_CURRENT_OUTPUTS/U_PDC_Gate_Driver (IC4_U_LOW_CURRENT_OUTPUTS_U_PDC_Gate_Driver#2.15)
LC8_GATE: U_LOW_CURRENT_OUTPUTS/U_PDC_Low_Current_Outputs (T3_U_LOW_CURRENT_OUTPUTS_U_PDC_Low_Current_Outputs#8.4), U_LOW_CURRENT_OUTPUTS/U_PDC_Gate_Driver (IC4_U_LOW_CURRENT_OUTPUTS_U_PDC_Gate_Driver#2.12)
LC8_OCSense: U_LOW_CURRENT_OUTPUTS/U_PDC_Low_Current_Outputs (IC5_U_LOW_CURRENT_OUTPUTS_U_PDC_Low_Current_Outputs#8.1 R8_U_LOW_CURRENT_OUTPUTS_U_PDC_Low_Current_Outputs#8.1 T3_U_LOW_CURRENT_OUTPUTS_U_PDC_Low_Current_Outputs#8.mb), U_LOW_CURRENT_OUTPUTS/U_PDC_Gate_Driver (IC4_U_LOW_CURRENT_OUTPUTS_U_PDC_Gate_Driver#2.13)
LC_1_OUTPUT: Superseal (X1.B13), U_LOW_CURRENT_OUTPUTS/U_PDC_Low_Current_Outputs (R9_U_LOW_CURRENT_OUTPUTS_U_PDC_Low_Current_Outputs#1.2 T3_U_LOW_CURRENT_OUTPUTS_U_PDC_Low_Current_Outputs#1.1 T3_U_LOW_CURRENT_OUTPUTS_U_PDC_Low_Current_Outputs#1.2 T3_U_LOW_CURRENT_OUTPUTS_U_PDC_Low_Current_Outputs#1.3)
LC_2_OUTPUT: Superseal (X1.B7), U_LOW_CURRENT_OUTPUTS/U_PDC_Low_Current_Outputs (R9_U_LOW_CURRENT_OUTPUTS_U_PDC_Low_Current_Outputs#2.2 T3_U_LOW_CURRENT_OUTPUTS_U_PDC_Low_Current_Outputs#2.1 T3_U_LOW_CURRENT_OUTPUTS_U_PDC_Low_Current_Outputs#2.2 T3_U_LOW_CURRENT_OUTPUTS_U_PDC_Low_Current_Outputs#2.3)
LC_3_OUTPUT: Superseal (X1.B26), U_LOW_CURRENT_OUTPUTS/U_PDC_Low_Current_Outputs (R9_U_LOW_CURRENT_OUTPUTS_U_PDC_Low_Current_Outputs#3.2 T3_U_LOW_CURRENT_OUTPUTS_U_PDC_Low_Current_Outputs#3.1 T3_U_LOW_CURRENT_OUTPUTS_U_PDC_Low_Current_Outputs#3.2 T3_U_LOW_CURRENT_OUTPUTS_U_PDC_Low_Current_Outputs#3.3)
LC_4_OUTPUT: Superseal (X1.B19), U_LOW_CURRENT_OUTPUTS/U_PDC_Low_Current_Outputs (R9_U_LOW_CURRENT_OUTPUTS_U_PDC_Low_Current_Outputs#4.2 T3_U_LOW_CURRENT_OUTPUTS_U_PDC_Low_Current_Outputs#4.1 T3_U_LOW_CURRENT_OUTPUTS_U_PDC_Low_Current_Outputs#4.2 T3_U_LOW_CURRENT_OUTPUTS_U_PDC_Low_Current_Outputs#4.3)
LC_5_OUTPUT: Superseal (X1.A1), U_LOW_CURRENT_OUTPUTS/U_PDC_Low_Current_Outputs (R9_U_LOW_CURRENT_OUTPUTS_U_PDC_Low_Current_Outputs#5.2 T3_U_LOW_CURRENT_OUTPUTS_U_PDC_Low_Current_Outputs#5.1 T3_U_LOW_CURRENT_OUTPUTS_U_PDC_Low_Current_Outputs#5.2 T3_U_LOW_CURRENT_OUTPUTS_U_PDC_Low_Current_Outputs#5.3)
LC_6_OUTPUT: Superseal (X1.A18), U_LOW_CURRENT_OUTPUTS/U_PDC_Low_Current_Outputs (R9_U_LOW_CURRENT_OUTPUTS_U_PDC_Low_Current_Outputs#6.2 T3_U_LOW_CURRENT_OUTPUTS_U_PDC_Low_Current_Outputs#6.1 T3_U_LOW_CURRENT_OUTPUTS_U_PDC_Low_Current_Outputs#6.2 T3_U_LOW_CURRENT_OUTPUTS_U_PDC_Low_Current_Outputs#6.3)
LC_7_OUTPUT: Superseal (X1.A10), U_LOW_CURRENT_OUTPUTS/U_PDC_Low_Current_Outputs (R9_U_LOW_CURRENT_OUTPUTS_U_PDC_Low_Current_Outputs#7.2 T3_U_LOW_CURRENT_OUTPUTS_U_PDC_Low_Current_Outputs#7.1 T3_U_LOW_CURRENT_OUTPUTS_U_PDC_Low_Current_Outputs#7.2 T3_U_LOW_CURRENT_OUTPUTS_U_PDC_Low_Current_Outputs#7.3)
LC_8_OUTPUT: Superseal (X1.A26), U_LOW_CURRENT_OUTPUTS/U_PDC_Low_Current_Outputs (R9_U_LOW_CURRENT_OUTPUTS_U_PDC_Low_Current_Outputs#8.2 T3_U_LOW_CURRENT_OUTPUTS_U_PDC_Low_Current_Outputs#8.1 T3_U_LOW_CURRENT_OUTPUTS_U_PDC_Low_Current_Outputs#8.2 T3_U_LOW_CURRENT_OUTPUTS_U_PDC_Low_Current_Outputs#8.3)
NetIC2_1: Gate_driver (IC3.3), E_stop (IC2.1 IC2.2)
NetIC2_3: Gate_driver (IC3.5), E_stop (IC2.3 IC2.4)
NetIC2_5: Gate_driver (IC3.7), E_stop (IC2.5 IC2.6)
NetIC2_7: Gate_driver (IC3.9), E_stop (IC2.7 IC2.8)
NetM1_4: Rectifier_shutdown_Gate (M1.4 M2.4 M3.4), Rectifier_shutdown_LT1910 (U3.5)
NetQ1_9: U_ANALOG_HC_OVERCURRENT_REDUNDANCY_CCT/U_Analog_HC_Overcurrent_Redundancy (R2_U_ANALOG_HC_OVERCURRENT_REDUNDANCY_CCT_U_Analog_HC_Overcurrent_Redundancy#4.2), Analog_HC_Overcurrent_MMPQ3904 (Q1.9)
NetQ1_11: U_ANALOG_HC_OVERCURRENT_REDUNDANCY_CCT/U_Analog_HC_Overcurrent_Redundancy (R2_U_ANALOG_HC_OVERCURRENT_REDUNDANCY_CCT_U_Analog_HC_Overcurrent_Redundancy#3.2), Analog_HC_Overcurrent_MMPQ3904 (Q1.11)
NetQ1_13: U_ANALOG_HC_OVERCURRENT_REDUNDANCY_CCT/U_Analog_HC_Overcurrent_Redundancy (R2_U_ANALOG_HC_OVERCURRENT_REDUNDANCY_CCT_U_Analog_HC_Overcurrent_Redundancy#2.2), Analog_HC_Overcurrent_MMPQ3904 (Q1.13)
NetQ1_15: U_ANALOG_HC_OVERCURRENT_REDUNDANCY_CCT/U_Analog_HC_Overcurrent_Redundancy (R2_U_ANALOG_HC_OVERCURRENT_REDUNDANCY_CCT_U_Analog_HC_Overcurrent_Redundancy#1.2), Analog_HC_Overcurrent_MMPQ3904 (Q1.15)
RECTIFIER_IN: Superseal (X1.B17 X1.B24), Rectifier_shutdown_Gate (M1.mb M2.mb M3.mb)
RECTIFIER_OUT: Superseal (X1.B18 X1.B25), Rectifier_shutdown_Gate (9 pins)
Relay_Sig_HC_1: Superseal (X1.A27), Input_Current_Limiting (R23.2)
Relay_Sig_HC_2: Superseal (X1.A19), Input_Current_Limiting (R20.2)
Relay_Sig_LC: Superseal (X1.A28), Input_Current_Limiting (R22.2)